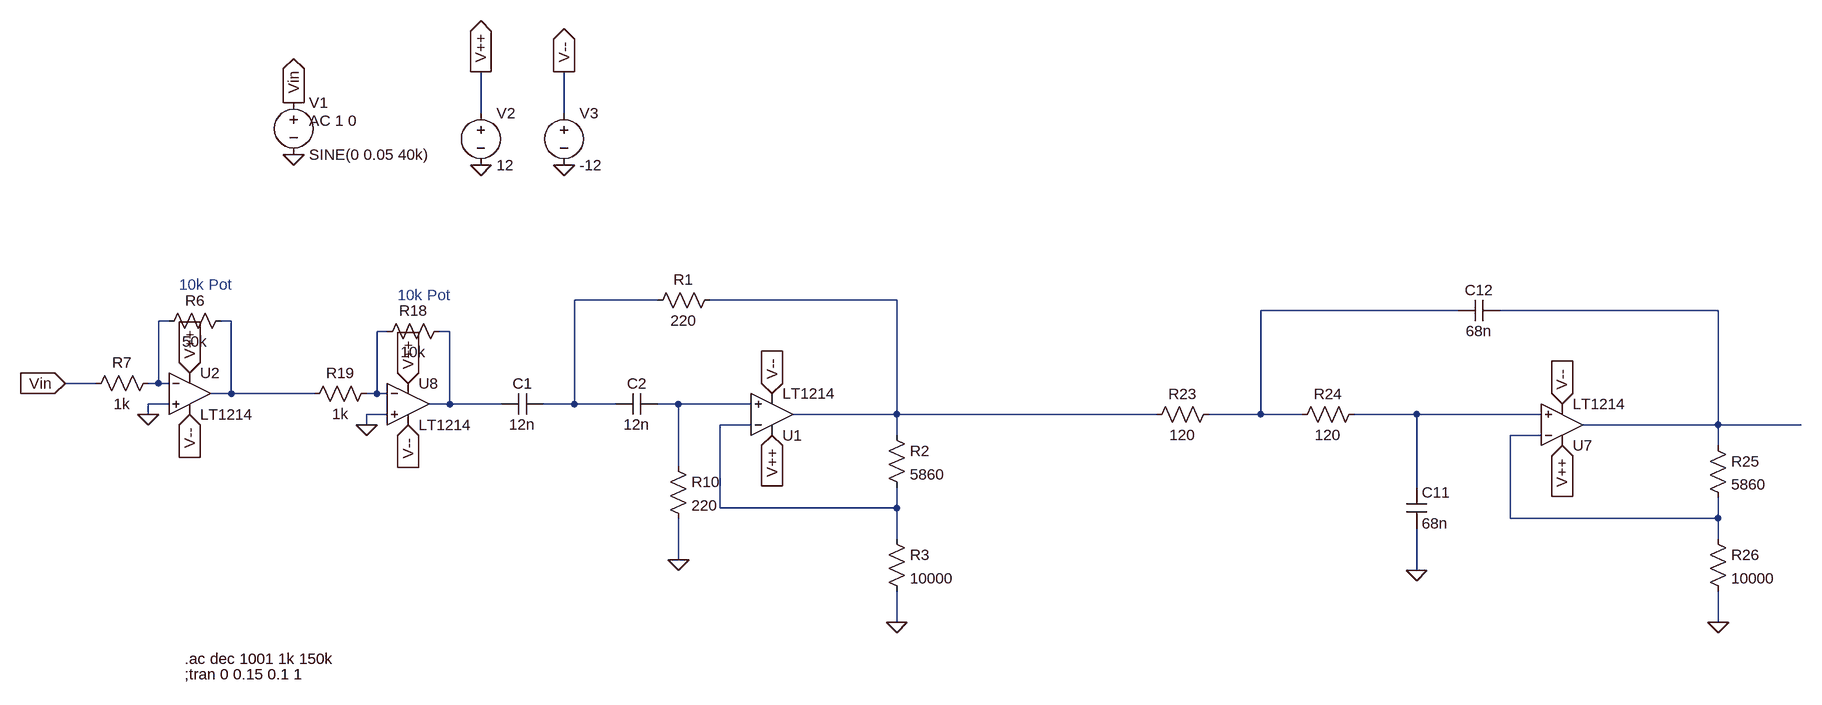
[diagram p0: schematic bandpassNew.asc]
bandpassNew.asc, the LTspice schematic file:
Version 4
SHEET 1 5732 1108
WIRE -16 -320 -16 -384
WIRE 112 -320 112 -384
WIRE 256 -32 128 -32
WIRE 624 -32 336 -32
WIRE 1488 -16 1184 -16
WIRE 1888 -16 1552 -16
WIRE -496 0 -512 0
WIRE -400 0 -416 0
WIRE -160 16 -176 16
WIRE -64 16 -80 16
WIRE -608 96 -656 96
WIRE -512 96 -512 0
WIRE -512 96 -528 96
WIRE -496 96 -512 96
WIRE -400 112 -400 0
WIRE -400 112 -432 112
WIRE -272 112 -400 112
WIRE -176 112 -176 16
WIRE -176 112 -192 112
WIRE -160 112 -176 112
WIRE -496 128 -528 128
WIRE -64 128 -64 16
WIRE -64 128 -96 128
WIRE 16 128 -64 128
WIRE 128 128 128 -32
WIRE 128 128 80 128
WIRE 192 128 128 128
WIRE 288 128 256 128
WIRE 400 128 288 128
WIRE -528 144 -528 128
WIRE -160 144 -192 144
WIRE 624 144 624 -32
WIRE 624 144 464 144
WIRE 1024 144 624 144
WIRE 1184 144 1184 -16
WIRE 1184 144 1104 144
WIRE 1248 144 1184 144
WIRE 1424 144 1328 144
WIRE 1616 144 1424 144
WIRE -192 160 -192 144
WIRE 400 160 352 160
WIRE 1888 160 1888 -16
WIRE 1888 160 1680 160
WIRE 2016 160 1888 160
WIRE 624 176 624 144
WIRE 1616 176 1568 176
WIRE 1888 192 1888 160
WIRE 288 224 288 128
WIRE 1424 256 1424 144
WIRE 352 288 352 160
WIRE 624 288 624 256
WIRE 624 288 352 288
WIRE 1568 304 1568 176
WIRE 1888 304 1888 272
WIRE 1888 304 1568 304
WIRE 624 336 624 288
WIRE 1888 336 1888 304
WIRE 288 368 288 304
WIRE 1424 384 1424 320
WIRE 624 464 624 416
WIRE 1888 464 1888 416
FLAG -16 -240 0
FLAG 112 -240 0
FLAG -16 -384 V++
IOPIN -16 -384 Out
FLAG 112 -384 V--
IOPIN 112 -384 Out
FLAG -304 -256 0
FLAG -304 -336 Vin
IOPIN -304 -336 Out
FLAG -528 144 0
FLAG -464 144 V--
IOPIN -464 144 In
FLAG -464 80 V++
IOPIN -464 80 In
FLAG -656 96 Vin
IOPIN -656 96 In
FLAG 432 112 V--
IOPIN 432 112 In
FLAG 432 176 V++
IOPIN 432 176 In
FLAG 624 464 0
FLAG 288 368 0
FLAG 1424 384 0
FLAG 1648 128 V--
IOPIN 1648 128 In
FLAG 1648 192 V++
IOPIN 1648 192 In
FLAG 1888 464 0
FLAG -192 160 0
FLAG -128 160 V--
IOPIN -128 160 In
FLAG -128 96 V++
IOPIN -128 96 In
SYMBOL voltage -16 -336 R0
WINDOW 123 0 0 Left 0
WINDOW 39 0 0 Left 0
SYMATTR InstName V2
SYMATTR Value 12
SYMBOL voltage 112 -336 R0
WINDOW 123 0 0 Left 0
WINDOW 39 0 0 Left 0
SYMATTR InstName V3
SYMATTR Value -12
SYMBOL voltage -304 -352 R0
WINDOW 123 24 44 Left 2
WINDOW 39 0 0 Left 0
SYMATTR Value2 AC 1 0
SYMATTR InstName V1
SYMATTR Value SINE(0 0.05 40k)
SYMBOL Opamps\\LT1214 -464 48 R0
SYMATTR InstName U2
SYMBOL res -400 -16 R90
WINDOW 0 0 56 VBottom 2
WINDOW 3 32 56 VTop 2
SYMATTR InstName R6
SYMATTR Value 50k
SYMBOL res -512 80 R90
WINDOW 0 0 56 VBottom 2
WINDOW 3 32 56 VTop 2
SYMATTR InstName R7
SYMATTR Value 1k
SYMBOL cap 80 112 R90
WINDOW 0 0 32 VBottom 2
WINDOW 3 32 32 VTop 2
SYMATTR InstName C1
SYMATTR Value 12n
SYMBOL cap 256 112 R90
WINDOW 0 0 32 VBottom 2
WINDOW 3 32 32 VTop 2
SYMATTR InstName C2
SYMATTR Value 12n
SYMBOL Opamps\\LT1214 432 208 M180
SYMATTR InstName U1
SYMBOL res 352 -48 R90
WINDOW 0 0 56 VBottom 2
WINDOW 3 32 56 VTop 2
SYMATTR InstName R1
SYMATTR Value 220
SYMBOL res 608 160 R0
SYMATTR InstName R2
SYMATTR Value 5860
SYMBOL res 608 320 R0
SYMATTR InstName R3
SYMATTR Value 10000
SYMBOL res 272 208 R0
SYMATTR InstName R10
SYMATTR Value 220
SYMBOL res 1120 128 R90
WINDOW 0 0 56 VBottom 2
WINDOW 3 32 56 VTop 2
SYMATTR InstName R23
SYMATTR Value 120
SYMBOL res 1344 128 R90
WINDOW 0 0 56 VBottom 2
WINDOW 3 32 56 VTop 2
SYMATTR InstName R24
SYMATTR Value 120
SYMBOL cap 1408 256 R0
SYMATTR InstName C11
SYMATTR Value 68n
SYMBOL cap 1552 -32 R90
WINDOW 0 0 32 VBottom 2
WINDOW 3 32 32 VTop 2
SYMATTR InstName C12
SYMATTR Value 68n
SYMBOL Opamps\\LT1214 1648 224 M180
SYMATTR InstName U7
SYMBOL res 1872 176 R0
SYMATTR InstName R25
SYMATTR Value 5860
SYMBOL res 1872 320 R0
SYMATTR InstName R26
SYMATTR Value 10000
SYMBOL Opamps\\LT1214 -128 64 R0
SYMATTR InstName U8
SYMBOL res -64 0 R90
WINDOW 0 0 56 VBottom 2
WINDOW 3 32 56 VTop 2
SYMATTR InstName R18
SYMATTR Value 10k
SYMBOL res -176 96 R90
WINDOW 0 0 56 VBottom 2
WINDOW 3 32 56 VTop 2
SYMATTR InstName R19
SYMATTR Value 1k
TEXT -472 520 Left 2 !.ac dec 1001 1k 150k
TEXT -480 -56 Left 2 ;10k Pot
TEXT -144 -40 Left 2 ;10k Pot
TEXT -472 544 Left 2 !;tran 0 0.15 0.1 1

The netlist it stands for:
* bandpassNew.asc
V2 V++ 0 12
V3 V-- 0 -12
V1 Vin 0 SINE(0 0.05 40k) AC 1 0
XU2 0 N005 V++ V-- N006 LT1213  ; LT1214, pins In+ In- V+ V- OUT
R6 N006 N005 50k
R7 N005 Vin 1k
C1 N001 N008 12n
C2 N009 N001 12n
XU1 N009 N011 V++ V-- N002 LT1213  ; LT1214, pins In+ In- V+ V- OUT
R1 N002 N001 220
R2 N002 N011 5860
R3 N011 0 10000
R10 N009 0 220
R23 N003 N002 120
R24 N010 N003 120
C11 N010 0 68n
C12 N004 N003 68n
XU7 N010 N012 V++ V-- N004 LT1213  ; LT1214, pins In+ In- V+ V- OUT
R25 N004 N012 5860
R26 N012 0 10000
XU8 0 N007 V++ V-- N008 LT1213  ; LT1214, pins In+ In- V+ V- OUT
R18 N008 N007 10k
R19 N007 N006 1k
.ac dec 1001 1k 150k
* 10k Pot
* 10k Pot
;tran 0 0.15 0.1 1
.lib LTC.lib
.backanno
.end